# Altium project A-865_ATMEGA1_BHARAT AERO (1).PrjPcb
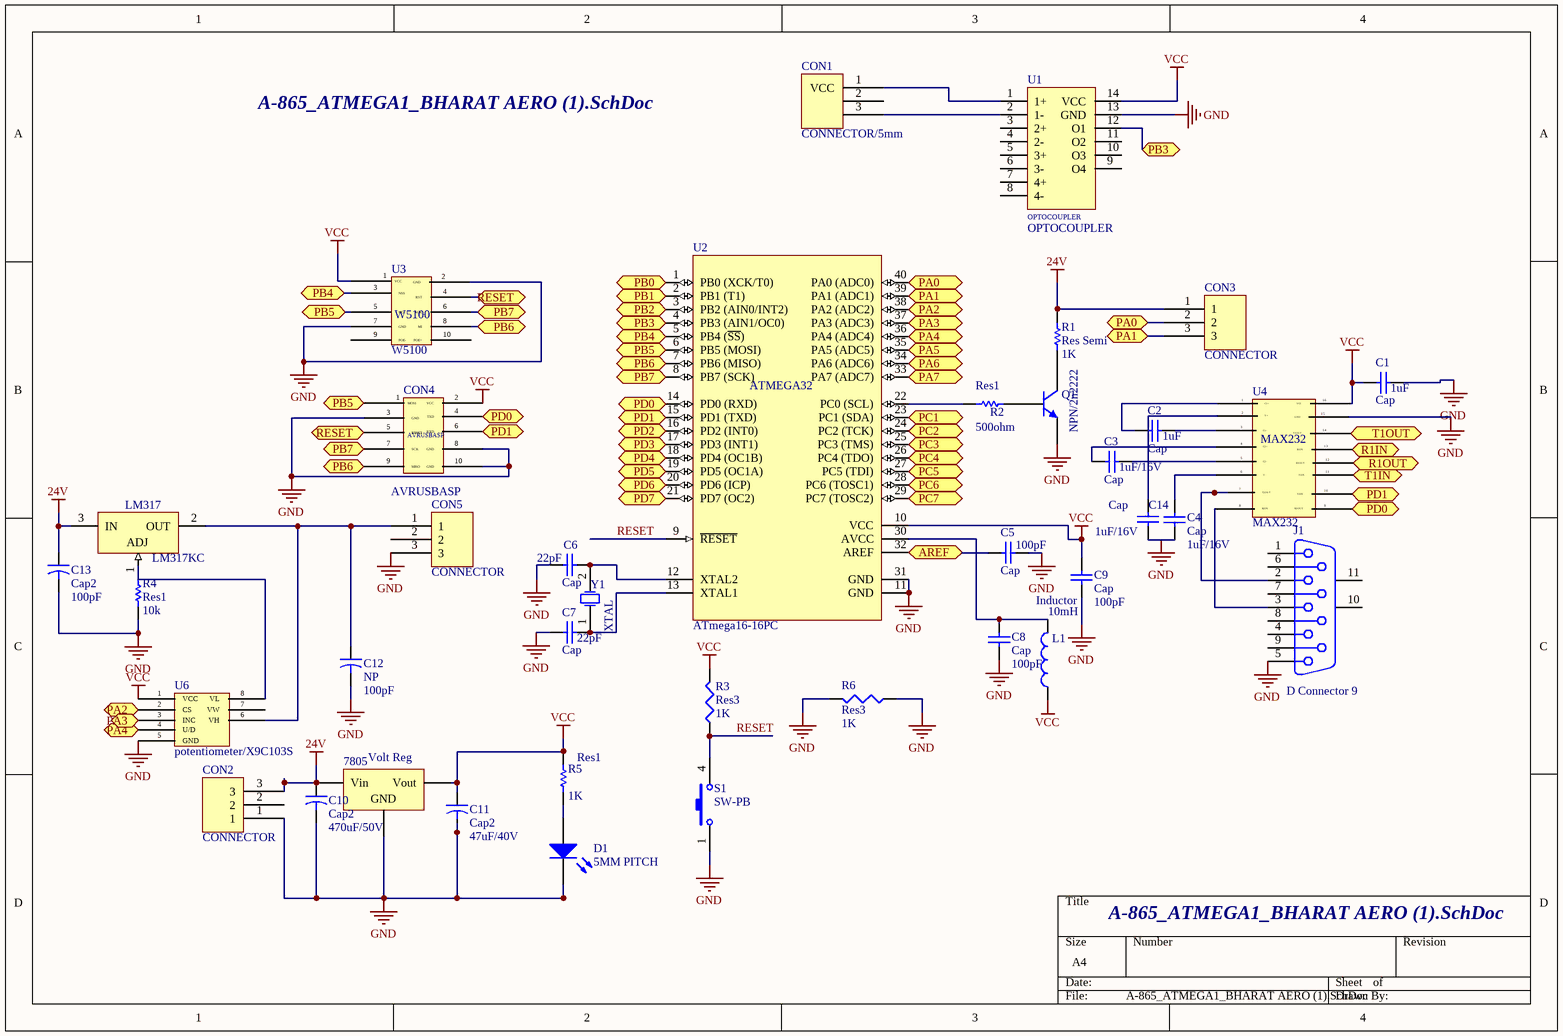
[diagram p0: A-865_ATMEGA1_BHARAT AERO (1).SchDoc]
1 sheet, 38 parts. Net scope: flat (ports and power ports of the same name join across sheets).
Board file: A-865_ATMEGA1_BHARAT AERO (1).PcbDoc

## Sheet A-865_ATMEGA1_BHARAT AERO (1).SchDoc
size A4

### Parts
7805  Volt Reg  [7805/TO220AB]
C1  Cap  value 1uF  [RAD/.150X.150/LS.100/.031]
C2  Cap  value 1uF  [RAD/.150X.150/LS.100/.031]
C3  Cap  value 1uF/16V  [RAD/.150X.150/LS.100/.031]
C4  Cap  value 1uF/16V  [RAD/.150X.150/LS.100/.031]
C5  Cap  value 100pF  [RAD/.150X.150/LS.100/.031]
C6  Cap  value 22pF  [RAD/.150X.150/LS.100/.031_10]
C7  Cap  value 22pF  [RAD/.150X.150/LS.100/.031_10]
C8  Cap  value 100pF  [RAD/.150X.150/LS.100/.031]
C9  Cap  value 100pF  [RAD/.150X.150/LS.100/.031]
C10  Cap2  value 470uF/50V  [100UF/16V]
C11  Cap2  value 47uF/40V  [100UF/16V]
C12  NP  value 100pF  [100UF/16V]
C13  Cap2  value 100pF  [100UF/16V]
C14  Cap  value 1uF/16V  [RAD/.150X.150/LS.100/.031]
CON1  CONNECTOR/5mm  [Applied- 3 pin 5.08mm pitch New1]
CON2  CONNECTOR  [Applied- 3 pin 5.08mm pitch New1]
CON3  CONNECTOR  [Applied- 3 pin 5.08mm pitch New1]
CON4  AVRUSBASP  [DIP10]
CON5  CONNECTOR  [Applied- 3 pin 5.08mm pitch New1]
D1  5MM PITCH  [LED_5MM]
J1  D Connector 9  [DSUB1.385-2H9]
L1  Inductor  value 10mH  [WE-7447462033]
LM317  LM317KC  [KC03]
Q1  NPN/2n2222  [TO-92 CASE 123]
R1  Res Semi  value 1K  [1.5K/AXIAL0.4_SMALL]
R2  Res1  value 500ohm  [1.5K/AXIAL0.4_SMALL]
R3  Res3  value 1K  [1.5K/AXIAL0.4_SMALL]
R4  Res1  value 10k  [1.5K/AXIAL0.4_SMALL]
R5  Res1  value 1K  [1.5K/AXIAL0.4_SMALL]
R6  Res3  value 1K  [RESISTANCE-1/4W]
S1  SW-PB  [TECTILE SWITCH-SW1]
U1  OPTOCOUPLER  [optocoupler]
U2  ATmega16-16PC  [40P6]
U3  W5100  [w5100]
U4  MAX232  [mx232]
U6  potentiometer/X9C103S  [potentiometer1]
Y1  XTAL  [CRYSTAL KDS16]

### Ports
AREF, PA0, PA1, PA2, PA3, PA4, PA5, PA6, PA7, PB0, PB1, PB2, PB3, PB4, PB5, PB6, PB7, PC1, PC2, PC3, PC4, PC5, PC6, PC7, PD0, PD1, PD2, PD3, PD4, PD5, PD6, PD7, R1IN, R1OUT, RESET, T1IN, T1OUT

### Nets
24V: 7805.1(Vin) C10.1 C13.1 CON2.3 CON3.1 LM317.3(IN) R1.2
GND: 7805.2(GND) C1.2 C5.2 C6.1 C7.1 C8.1 C9.1 C10.2 C11.2 C12.2 C13.2 CON2.1 CON4.3(GND) CON4.8(GND) CON4.10(GND) CON5.3 D1.2(K) J1.5 Q1.3(E) R4.1 R6.1 R6.2 S1.1 U1.13(GND) U2.11(GND) U2.31(GND) U3.2(GND) U3.7(GND) U4.15(GND) U6.5(GND)
VCC: 7805.3(Vout) C1.1 C9.2 C11.1 CON4.2(VCC) L1.1 R3.2 R5.2 U1.14(VCC) U2.10(VCC) U3.1(VCC) U4.16(VCC) U6.1(VCC)
RESET: R3.1 S1.4 U2.9(~{RESET})
NetC2_1: C2.1 U4.1(C1+)
NetC2_2: C2.2 U4.3(C1-)
NetC3_1: C3.1 U4.4(C2+)
NetC3_2: C3.2 U4.5(C2-)
NetC4_1: C4.1 U4.6(V-)
NetC4_2: C4.2 C14.2
NetC5_1: C5.1 U2.32(AREF) ; port AREF
NetC6_2: C6.2 U2.12(XTAL2) Y1.2(OSC2)
NetC7_2: C7.2 U2.13(XTAL1) Y1.1(OSC1)
NetC8_2: C8.2 L1.2 U2.30(AVCC)
NetC12_1: C12.1 CON5.1 LM317.2(OUT) U6.6(VH)
NetC14_1: C14.1 U4.2(V+)
NetCON1_1: CON1.1(VCC) U1.1(1+)
NetCON1_3: CON1.3 U1.2(1-)
NetCON3_2: CON3.2 U2.40(PA0_(ADC0)) ; port PA0
NetCON3_3: CON3.3 U2.39(PA1_(ADC1)) ; port PA1
NetCON4_1: CON4.1(MOSI) U2.6(PB5_(MOSI)) U3.5(MO) ; port PB5
NetCON4_4: CON4.4(TXD) U2.14(PD0_(RXD)) U4.9(R2OUT) ; port PD0
NetCON4_5: CON4.5(RESET) U3.4(RST) ; port RESET
NetCON4_6: CON4.6(RXD) U2.15(PD1_(TXD)) U4.10(T2IN) ; port PD1
NetCON4_7: CON4.7(SCK) U2.8(PB7_(SCK)) U3.6(SCK) ; port PB7
NetCON4_9: CON4.9(MISO) U2.7(PB6_(MISO)) U3.8(MI) ; port PB6
NetD1_1: D1.1(A) R5.1
NetJ1_2: J1.2 U4.7(T2OUT)
NetJ1_3: J1.3 U4.8(R2IN)
NetQ1_1: Q1.1(C) R1.1
NetQ1_2: Q1.2(B) R2.2
NetR2_1: R2.1 U2.22(PC0_(SCL))
NetR4_2: R4.2 U6.8(VL)
NetU1_12: U1.12(O1) U2.4(PB3_(AIN1/OC0)) ; port PB3
NetU2_1: U2.1(PB0_(XCK/T0)) ; port PB0
NetU2_2: U2.2(PB1_(T1)) ; port PB1
NetU2_3: U2.3(PB2_(AIN0/INT2)) ; port PB2
NetU2_5: U2.5(PB4_(~{SS})) U3.3(NSS) ; port PB4
NetU2_16: U2.16(PD2_(INT0)) ; port PD2
NetU2_17: U2.17(PD3_(INT1)) ; port PD3
NetU2_18: U2.18(PD4_(OC1B)) ; port PD4
NetU2_19: U2.19(PD5_(OC1A)) ; port PD5
NetU2_20: U2.20(PD6_(ICP)) ; port PD6
NetU2_21: U2.21(PD7_(OC2)) ; port PD7
NetU2_23: U2.23(PC1_(SDA)) ; port PC1
NetU2_24: U2.24(PC2_(TCK)) ; port PC2
NetU2_25: U2.25(PC3_(TMS)) ; port PC3
NetU2_26: U2.26(PC4_(TDO)) ; port PC4
NetU2_27: U2.27(PC5_(TDI)) ; port PC5
NetU2_28: U2.28(PC6_(TOSC1)) ; port PC6
NetU2_29: U2.29(PC7_(TOSC2)) ; port PC7
NetU2_33: U2.33(PA7_(ADC7)) ; port PA7
NetU2_34: U2.34(PA6_(ADC6)) ; port PA6
NetU2_35: U2.35(PA5_(ADC5)) ; port PA5
NetU2_36: U2.36(PA4_(ADC4)) U6.4(U/D) ; port PA4
NetU2_37: U2.37(PA3_(ADC3)) U6.3(INC) ; port PA3
NetU2_38: U2.38(PA2_(ADC2)) U6.2(CS) ; port PA2
NetU4_11: U4.11(T1IN) ; port T1IN
NetU4_12: U4.12(R1OUT) ; port R1OUT
NetU4_13: U4.13(R1IN) ; port R1IN
NetU4_14: U4.14(T1OUT) ; port T1OUT

Not connected (* = marked no-connect by the designer): CON1 2; CON2 2; CON5 2; J1 1 4 6 7 8 9 10(MH1) 11(MH2); LM317 1(ADJ); U1 3(2+) 4(2-) 5(3+) 6(3-) 7(4+) 8(4-) 9(O4) 10(O3) 11(O2); U3 9(POE-) 10(POE+); U6 7(VW)

### Notes on the sheet
- A-865_ATMEGA1_BHARAT AERO (1).SchDoc
- (near U2) ATMEGA32
- Labels drawn without touching a wire or pin: GND

### Library data of the parts
7805 = Volt Reg: Voltage Regulator; Published: 24-Mar-1999; LatestRevisionDate: 29-May-2009; LatestRevisionNote: IPC-7351 Footprint Added.; PackageReference: D2PAK; Publisher: Altium Limited; PackageDescription: 3-Pin Transistor Outline Package 2.54 mm Pitch, 15.1 mm Lead Span
C1-C9 C14 = Cap: Capacitor; Published: 8-Jun-2000; LatestRevisionDate: 17-Jul-2002; LatestRevisionNote: Re-released for DXP Platform.; PackageReference: RAD-0.3; Publisher: Altium Limited; PackageDescription: Radial Cap, Thru-Hole; 2 Leads; 0.3 in Pin Spacing
C10-C13 = Cap2: Capacitor; Published: 23-Sep-2002; PackageReference: CAPR5-4X5; Publisher: Altium Limited; PackageDescription: Capacitor; 2 Leads
CON1 = CONNECTOR
CON4 = avrusb asp
D1 = LED0: Typical INFRARED GaAs LED; Published: 8-Jun-2000; LatestRevisionDate: 08-Jul-2005; LatestRevisionNote: Mech Layer 1 removed.; PackageReference: LED-0; Publisher: Altium Limited; PackageDescription: LED; 2 Leads
J1 = D Connector 9: Receptacle Assembly, 9 Position, Right Angle; PackageDocument: O; Positions: 9; Published: 15-Jun-2001; LatestRevisionDate: 17-Jul-2002; LatestRevisionNote: Re-released for DXP Platform.; DatasheetDocument: 1-Sep-1999; PackageReference: 788750; Publisher: Altium Limited; Orientation: Right Angle; Gender: Receptacle
L1 = Inductor: Code_IEC: 1005; Published: 8-Jun-2000; LatestRevisionDate: 29-May-2009; LatestRevisionNote: IPC-7351 Footprint Added.; PackageReference: 0402-A; Publisher: Altium Limited; PackageDescription: Chip Inductor; Code_JEITA: 0402
LM317 = LM317KC: 3-Terminal Adjustable Regulator; Note: Pin 2 is electrically connected to tab; Published: 15-Apr-2002; DatasheetVersion: Feb-1988; PackageVersion: Sep-1995; PackageReference: KC03; Publisher: Altium Limited; PackageDescription: TO, Thru-Hole, Vertical, Heatsink Mounted; 3 In-Line Leads; Pitch 2.54 mm; ComponentLink1Description: Manufacturer Link; ComponentLink1URL: http://www.ti.com/
Q1 = NPN: NPN Bipolar Transistor; Published: 8-Jun-2000; LatestRevisionDate: 17-Jul-2002; LatestRevisionNote: Re-released for DXP Platform.; PackageReference: TO-226-AA; Publisher: Altium Limited; PackageDescription: TO, Flat Index; 3 In-Line, Axial Leads; Body Dia. 4.8mm; Leads 0.55 x 0.51 mm (max); Code_JEDEC: TO-226-AA
R1 = Res Semi: Semiconductor Resistor; Published: 8-Jun-2000; LatestRevisionDate: 17-Jul-2002; LatestRevisionNote: Re-released for DXP Platform.; PackageReference: AXIAL-0.5; Publisher: Altium Limited; PackageDescription: Axial Device, Thru-Hole; 2 Leads; 0.5 in Pin Spacing
R2 R4 R5 = Res1: Resistor; Published: 8-Jun-2000; LatestRevisionDate: 17-Jul-2002; LatestRevisionNote: Re-released for DXP Platform.; PackageReference: AXIAL-0.3; Publisher: Altium Limited; PackageDescription: Axial Device, Thru-Hole; 2 Leads; 0.3 in Pin Spacing
R3 R6 = Res3: Resistor; Published: 8-Jun-2000; LatestRevisionDate: 29-May-2009; LatestRevisionNote: IPC-7351 Footprint Added.; PackageReference: J1-0603; Publisher: Altium Limited; PackageDescription: Chip Resistor
S1 = SW-PB: Switch; Published: 24-Mar-1999; LatestRevisionDate: 17-Jul-2002; LatestRevisionNote: Re-released for DXP Platform.; PackageReference: SPST-2; Publisher: Altium Limited; PackageDescription: Switch; 2 Leads
U2 = ATmega16-16PC: 8-Bit AVR Microcontroller with 16K Bytes of In-System Programmable Flash Memory; Published: 17-Sep-2003; DatasheetVersion: 2466E-AVR-10/02; PackageVersion: revB, Sep-2001; PackageReference: 40P6; Publisher: Altium Limited; PackageDescription: 40-lead (0.600"/15.24mm Wide) Plastic Dual Inline Package (PDIP); Supplier 1: Digi-Key; Supplier Part Number 1: ATMEGA16-16PC-ND; Supplier 2: Mouser; Supplier Part Number 2: 556-ATMEGA16-16PC; Code_JEDEC: MS-011-AC; ComponentLink1Description: Datasheet; ComponentLink1URL: http://www.atmel.com/dyn/resources/prod_documents/doc2466.pdf; ComponentLink2Description: Atmel.com Home; ComponentLink2URL: http://www.atmel.com
U6 = POTENTIOMETER1
Y1 = XTAL: Crystal Oscillator; Published: 8-Jun-2000; LatestRevisionDate: 17-Jul-2002; LatestRevisionNote: Re-released for DXP Platform.; PackageReference: R38; Publisher: Altium Limited; PackageDescription: Crystal, Thru-Hole; 2 Leads; Body 3.1 x 8.2 mm (Dia.xH)